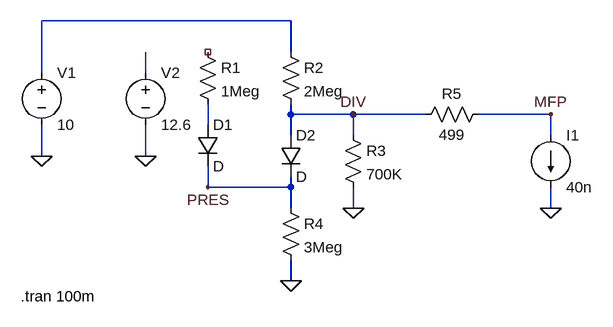
[diagram p0: schematic MFP.asc]
MFP.asc, the LTspice schematic file:
Version 4
SHEET 1 936 680
WIRE 432 48 48 48
WIRE 432 96 432 48
WIRE 48 128 48 48
WIRE 208 128 208 96
WIRE 432 192 432 176
WIRE 528 192 432 192
WIRE 640 192 528 192
WIRE 832 192 720 192
WIRE 304 208 304 176
WIRE 432 224 432 192
WIRE 528 224 528 192
WIRE 832 224 832 192
WIRE 48 256 48 208
WIRE 208 256 208 208
WIRE 304 304 304 272
WIRE 432 304 432 288
WIRE 432 304 304 304
WIRE 432 336 432 304
WIRE 528 336 528 304
WIRE 832 336 832 304
WIRE 432 448 432 416
FLAG 528 336 0
FLAG 432 448 0
FLAG 832 336 0
FLAG 48 256 0
FLAG 832 192 MFP
FLAG 304 304 PRES
FLAG 528 192 DIV
FLAG 208 256 0
SYMBOL res 288 80 R0
SYMATTR InstName R1
SYMATTR Value 1Meg
SYMBOL res 416 80 R0
SYMATTR InstName R2
SYMATTR Value 2Meg
SYMBOL res 512 208 R0
SYMATTR InstName R3
SYMATTR Value 700K
SYMBOL res 416 320 R0
SYMATTR InstName R4
SYMATTR Value 3Meg
SYMBOL res 736 176 R90
WINDOW 0 0 56 VBottom 2
WINDOW 3 32 56 VTop 2
SYMATTR InstName R5
SYMATTR Value 499
SYMBOL voltage 48 112 R0
SYMATTR InstName V1
SYMATTR Value 10
SYMBOL voltage 208 112 R0
SYMATTR InstName V2
SYMATTR Value 12.6
SYMBOL current 832 224 R0
WINDOW 123 0 0 Left 0
WINDOW 39 0 0 Left 0
SYMATTR InstName I1
SYMATTR Value 40n
SYMBOL diode 288 208 R0
SYMATTR InstName D1
SYMBOL diode 416 224 R0
SYMATTR InstName D2
TEXT 16 472 Left 2 !.tran 100m

The netlist it stands for:
* MFP.asc
R1 NC_01 N003 1Meg
R2 N001 DIV 2Meg
R3 DIV 0 700K
R4 PRES 0 3Meg
R5 MFP DIV 499
V1 N001 0 10
V2 N002 0 12.6
I1 MFP 0 40n
D1 N003 PRES D
D2 DIV PRES D
.model D D
.lib standard.dio
.tran 100m
.backanno
.end